# Altium schematic sheet 3_InfoPerif.SchDoc
size 414 x 293 mm; SheetNumber: 3; SheetTotal: 4
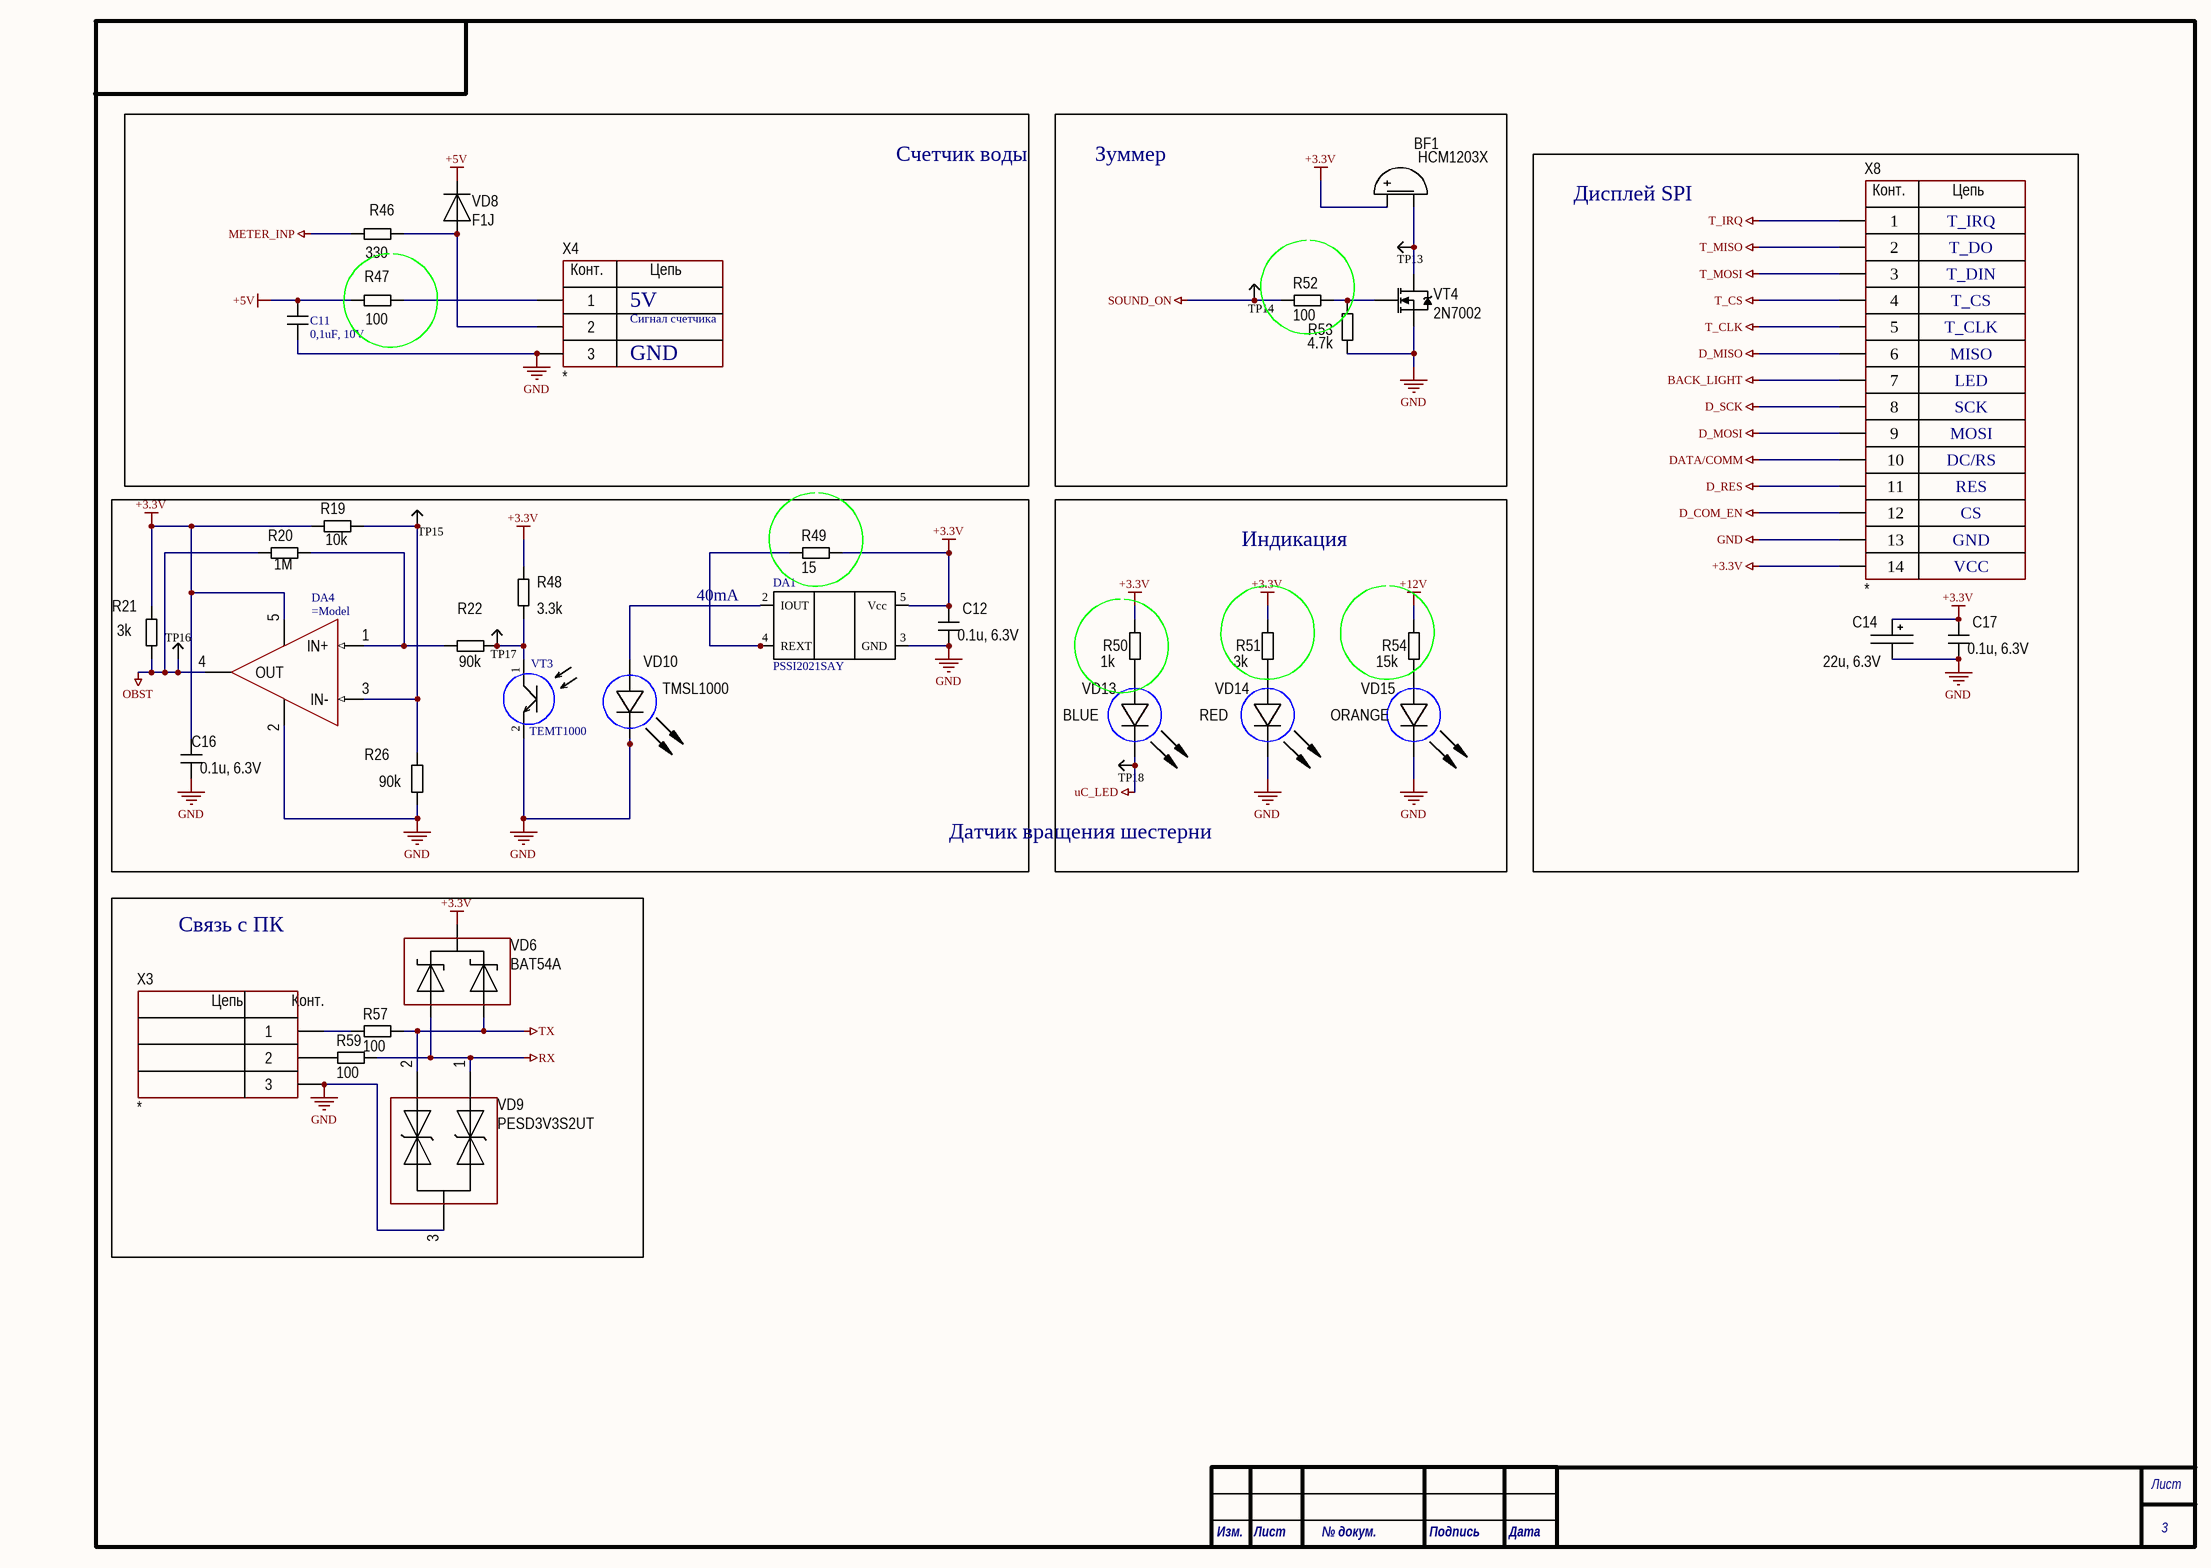
[diagram p0: 3_InfoPerif.SchDoc]

## Parts
BF1  HCM1203X  [BUZ: AI-1223-TWT-3V-2-R]
C11  0,1uF, 10V  [C_0603]
C12  0.1u, 6.3V  [CH0805C]
C14  22u, 6.3V  [TANTAL_B]
C16  0.1u, 6.3V  [CH0805C]
C17  0.1u, 6.3V  [CH0805C]
DA1  PSSI2021SAY  [SOT353]
DA4  (no value)  [SOT23-5]
R19  10k  [CH0603R]
R20  1M  [CH0603R]
R21  3k  [CH0603R]
R22  90k  [CH0805R]
R26  90k  [CH0603R]
R46  330  [CH0603R]
R47  100  [CH2512R]
R48  3.3k  [CH0603R]
R49  15  [CH0805R]
R50  1k  [CH0805R]
R51  3k  [CH0805R]
R52  100  [CH0805R]
R53  4.7k  [CH0603R]
R54  15k  [CH0805R]
R57  100  [CH0603R]
R59  100  [CH0603R]
TP13  (no value)  [TestPoint]
TP14  (no value)  [TestPoint]
TP15  (no value)  [TestPoint]
TP16  (no value)  [TestPoint]
TP17  (no value)  [TestPoint]
TP18  (no value)  [TestPoint]
VD6  BAT54A  [SOT23_123]
VD8  F1J  [SOD123F]
VD9  PESD3V3S2UT  [SOT23_132]
VD10  TMSL1000  [TSML1000]
VD13  BLUE  [CH0603LB]
VD14  RED  [CH0603LB]
VD15  ORANGE  [CH0603LB]
VT3  TEMT1000  [TEMT1000]
VT4  2N7002  [SOT23_123]
X3  *  [CON: CWF-3]
X4  *  [CON: CWF-3]
X8  *  [DS1024-14]

## Blocks framed on the sheet
Зуммер: BF1 R52 R53 TP13 TP14 VT4
Дисплей SPI: C14 C17 X8
Датчик вращения шестерни: C12 C16 DA1 DA4 R19-R22 R26 R48 R49 TP15-TP17 VD10 VT3
Индикация: R50 R51 R54 TP18 VD13-VD15
Связь с ПК: R57 R59 VD6 VD9 X3

## Nets
+3.3V: BF1.1(+) C12.2 C14.1 C16.2 C17.2 DA4.5(V+) R19.2 R21.2 R48.2 R49.2 R50.2 R51.2 VD6.2 X8.14
+5V: C11.2 R47.1 VD8.2
+12V: R54.2
BACK_LIGHT: X8.7
D_COM_EN: X8.12
D_MISO: X8.6
D_MOSI: X8.9
D_RES: X8.11
D_SCK: X8.8
DATA/COMM: X8.10
GND: C11.1 C12.1 C14.2 C16.1 C17.1 DA1.3(GND) DA4.2(V-) R26.1 R53.1 VD9.3 VD10.2(C) VD14.2(C) VD15.2(C) VT3.2 VT4.3(S) X3.3 X4.3 X8.13
METER_INP: R46.1
OBST: DA4.4(OUT) R20.2 R21.1 TP16.0
RX: R59.2 VD6.3 VD9.1
SOUND_ON: R52.2 TP14.0
T_CLK: X8.5
T_CS: X8.4
T_IRQ: X8.1
T_MISO: X8.2
T_MOSI: X8.3
TX: R57.2 VD6.1 VD9.2
uC_LED: TP18.0 VD13.2(C)
NetBF1_2: BF1.2(-) TP13.0 VT4.2(D)
NetDA1_2: DA1.2(IOUT) VD10.1(A)
NetDA1_4: DA1.4(REXT) R49.1
NetDA4_1: DA4.1(IN+) R20.1 R22.2
NetDA4_3: DA4.3(IN-) R19.1 R26.2 TP15.0
NetR22_1: R22.1 R48.1 TP17.0 VT3.1
NetR46_2: R46.2 VD8.1 X4.2
NetR47_2: R47.2 X4.1
NetR50_1: R50.1 VD13.1(A)
NetR51_1: R51.1 VD14.1(A)
NetR52_1: R52.1 R53.2 VT4.1(G)
NetR54_1: R54.1 VD15.1(A)
NetR57_1: R57.1 X3.1
NetR59_1: R59.1 X3.2

Not connected (* = marked no-connect by the designer): DA1 5(Vcc)

## Notes on the sheet
- Счетчик воды
- T_IRQ
- 5V
- T_DO
- T_DIN
- T_CS
- GND
- Сигнал счетчика
- T_CLK
- MISO
- LED
- SCK
- MOSI
- DC/RS
- RES
- CS
- VCC
- 40mA
- Лист
- Изм.
- № докум.
- Подпись
- Дата
- (in symbol 3-Connector) Конт.; Цепь
- (in symbol 14-Connector) Конт.; Цепь

## Library data of the parts
BF1 = Buzzer: Manufacturer: PUI Audio, Inc.; Model: AI-1223-TWT-3V-2-R; HelpURL: https://www.digikey.com/product-detail/en/pui-audio-inc/AI-1223-TWT-3V-2-R/668-1456-ND/5011391; ComponentKind: Internally Driven
C11 = C_SMD
C12 C16 = Capacitor: 0805; Manufacturer: *; Model: *; HelpURL: *; ComponentKind: *; Value: *
C14 = TantalCap: Manufacturer: *; Model: *; HelpURL: *; ComponentKind: *; Value: *
C17 = Capacitor: Manufacturer: *; Model: *; HelpURL: *; ComponentKind: *; Value: *
DA1 = PSSI2021SAY: Iout = 0.617/Rext + 15 µA
DA4 = LMV331M5: SOT23-5
R19-R22 R26 R46 R47 R50-R54 R57 R59 = Resistor: Manufacturer: *; Model: *; HelpURL: *; ComponentKind: *; Value: *
R48 R49 = Resistor: 0805; Manufacturer: *; Model: *; HelpURL: *; ComponentKind: *; Value: *
TP13-TP18 = TestPoint
VD6 = Diod Schottky Array v.1: ComponentKind: *; Manufacturer: *; Model: *; HelpURL: *
VD8 = Diod: ComponentKind: *; Manufacturer: *; Model: *; HelpURL: *
VD9 = TVS Array: ComponentKind: *; Manufacturer: *; Model: *; HelpURL: *
VD10 VD13-VD15 = LED_1: Manufacturer: *; Model: *; HelpURL: *; ComponentKind: *; Value: *
VT4 = N-chanel: Mosfet; Model: *; Manufacturer: *; ComponentKind: *; HelpURL: *
X3 X4 = 3-Connector: Model: *; Manufacturer: *; HelpURL: *; ComponentKind: *
X8 = 14-Connector: Model: *; Manufacturer: *; HelpURL: *; ComponentKind: *